# Altium schematic sheet Sch_front.SchDoc
size A
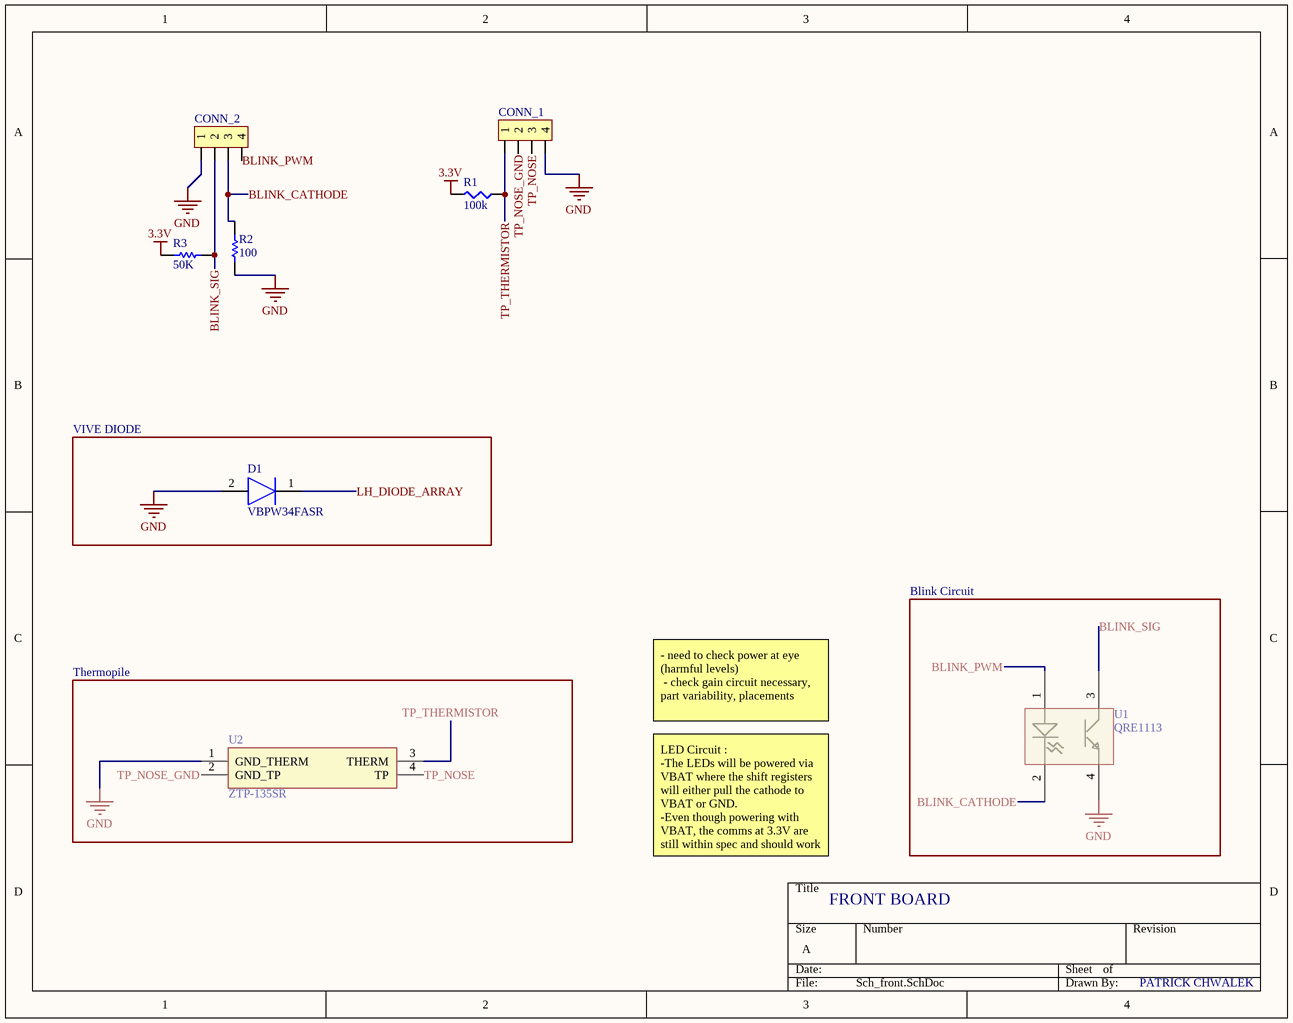
[diagram p0: Sch_front.SchDoc]

## Parts
CONN_1  THERMO  [4_pos_1mm_header]  (value not drawn)
CONN_2  BLINK  [4_pos_1mm_header]  (value not drawn)
D1  VBPW34FASR  [VBPW34FAS]
R1  100k  [SMD-0402-RES]
R2  100  [0402R]
R3  50K  [0402R]
U1  QRE1113  [QRE1113_DIP]
U2  ZTP-135SR  [ZTP-135SR]

## Blocks framed on the sheet
VIVE DIODE: D1
Blink Circuit: U1
Thermopile: U2

## Nets
3.3V: R1.2 R3.2
GND: CONN_1.4 CONN_2.1 D1.2(K) R2.1 U1.4 U2.1(GND_THERM)
BLINK_CATHODE: CONN_2.3 R2.2 U1.2
BLINK_PWM: CONN_2.4 U1.1
BLINK_SIG: CONN_2.2 R3.1 U1.3
LH_DIODE_ARRAY: D1.1(A)
TP_NOSE: CONN_1.3 U2.4(TP)
TP_NOSE_GND: CONN_1.2 U2.2(GND_TP)
TP_THERMISTOR: CONN_1.1 R1.1 U2.3(THERM)

## Notes on the sheet
- - need to check power at eye  (harmful levels)
  - check gain circuit necessary, part variability, placements
- LED Circuit :
  -The LEDs will be powered via VBAT where the shift registers will either pull the cathode to VBAT or GND.
  -Even though powering with VBAT, the comms at 3.3V are still within spec and should work
- FRONT BOARD
- PATRICK CHWALEK

## Library data of the parts
CONN_1 CONN_2 = 4_pin_1mm_header
D1 = VBPW34FASR: Diode; Manufacturer_Name: Vishay; Datasheet Link: https://www.vishay.com/docs/81127/vbpw34fa.pdf; Height: 1.3mm; Manufacturer_Part_Number: VBPW34FASR; Mouser Part Number: 782-VBPW34FASR; Mouser Price/Stock: https://www.mouser.com/Search/Refine.aspx?Keyword=782-VBPW34FASR; RS Part Number: 7689401; RS Price/Stock: https://uk.rs-online.com/web/p/products/7689401
R1 = ERJ-2GEJ104X: RES SMD 100K OHM 5% 1/10W 0402; Manufacturer: Panasonic Electronic Components; Factory Stock: 0; Unit Price (USD): 0.00350; @ qty: 1500; Minimum Quantity: 1; Power (Watts): 0.1W, 1/10W; Temperature Coefficient: ±200ppm/°C; Part Number: ERJ-2GEJ104X; Datasheets: http://industrial.panasonic.com/www-cgi/jvcr13pz.cgi?E+PZ+3+AOA0001+ERJ2GEJ104X+7+WW; Image: //media.digikey.com/Photos/Panasonic%20Photos/ERJ-PA2-Series.jpg; Digi-Key Part Number: P100KJCT-ND; Quantity Available: 2387986; Packaging: Cut Tape (CT); Series: ERJ; Part Status: Active; Value: 100k; Tolerance: ±5%; Composition: Thick Film; Features: Automotive AEC-Q200; Operating Temperature: -55°C ~ 155°C; Package / Case: 0402 (1005 Metric); Supplier Device Package: 0402; Size / Dimension: 0.039" L x 0.020" W (1.00mm x 0.50mm); Height - Seated (Max): 0.016" (0.40mm); Number of Terminations: 2; Failure Rate: -
R2 R3 = Resistor
U1 = QRE1113: IR Emitter and Receiver
U2 = ZTP-135SR: Undefined or Miscellaneous; Manufacturer_Name: Amphenol Advanced Sensors; Allied_Number: 70282698; Datasheet Link: https://www.amphenol-sensors.com/en/component/edocman/370-thermopile-ir-sensor-applications/download?Itemid=7967; Manufacturer_Part_Number: ZTP-135SR; Mouser Part Number: 527-ZTP-135SR; Mouser Price/Stock: https://www.mouser.com/Search/Refine.aspx?Keyword=527-ZTP-135SR; Allied Price/Stock: https://www.alliedelec.com/amphenol-advanced-sensors-ztp-135sr/70282698/